# Altium schematic sheet _io.SchDoc
size Tabloid
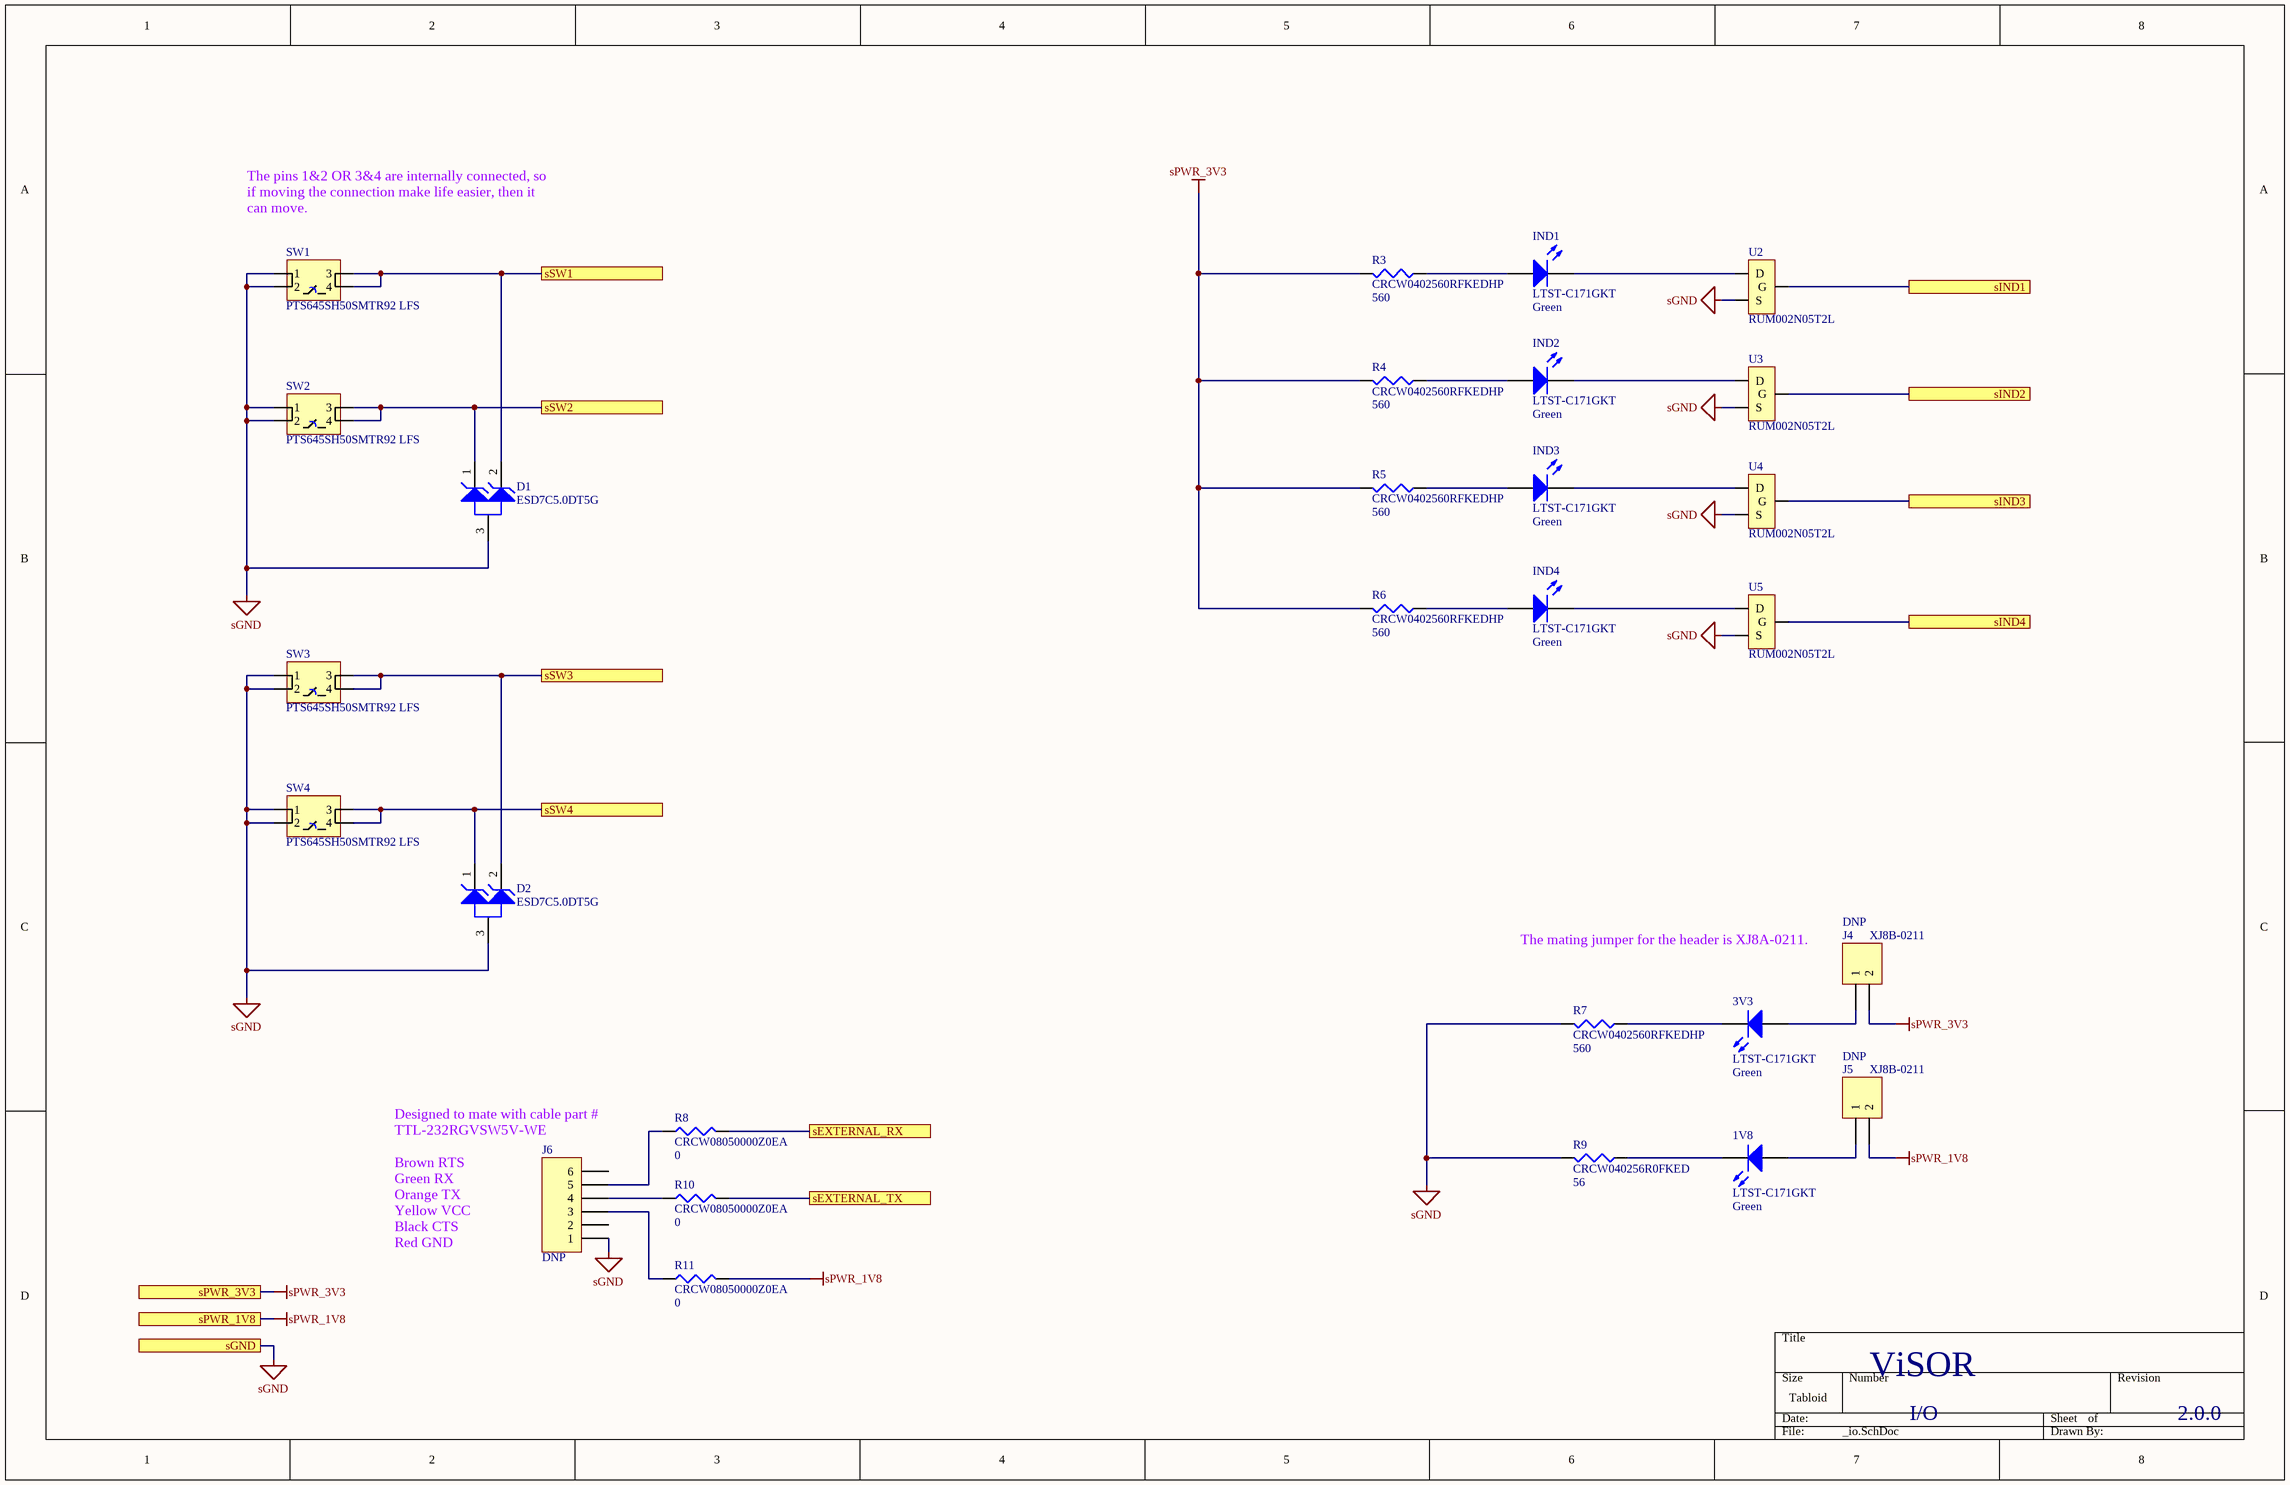
[diagram p0: _io.SchDoc]

## Parts
1V8  LTST-C171GKT  Color: Green  [0805]
3V3  LTST-C171GKT  Color: Green  [0805]
D1  ESD7C5.0DT5G  [ONSC-SOT-723-3-631AA-01_V]
D2  ESD7C5.0DT5G  [ONSC-SOT-723-3-631AA-01_V]
IND1  LTST-C171GKT  Color: Green  [0805]
IND2  LTST-C171GKT  Color: Green  [0805]
IND3  LTST-C171GKT  Color: Green  [0805]
IND4  LTST-C171GKT  Color: Green  [0805]
J4  XJ8B-0211  [HDR1X2]
J5  XJ8B-0211  [HDR1X2]
J6  DNP  [HDR1X6]
R3  CRCW0402560RFKEDHP  value 560  [0402]
R4  CRCW0402560RFKEDHP  value 560  [0402]
R5  CRCW0402560RFKEDHP  value 560  [0402]
R6  CRCW0402560RFKEDHP  value 560  [0402]
R7  CRCW0402560RFKEDHP  value 560  [0402]
R8  CRCW08050000Z0EA  value 0  [6-0805_M]
R9  CRCW040256R0FKED  value 56  [0402]
R10  CRCW08050000Z0EA  value 0  [6-0805_M]
R11  CRCW08050000Z0EA  value 0  [6-0805_M]
SW1  PTS645SH50SMTR92 LFS  [PTS645SH50SMTR92 LFS]
SW2  PTS645SH50SMTR92 LFS  [PTS645SH50SMTR92 LFS]
SW3  PTS645SH50SMTR92 LFS  [PTS645SH50SMTR92 LFS]
SW4  PTS645SH50SMTR92 LFS  [PTS645SH50SMTR92 LFS]
U2  RUM002N05T2L  [RUM002N05T2L]
U3  RUM002N05T2L  [RUM002N05T2L]
U4  RUM002N05T2L  [RUM002N05T2L]
U5  RUM002N05T2L  [RUM002N05T2L]

## Ports
sEXTERNAL_RX, sEXTERNAL_TX, sGND, sIND1, sIND2, sIND3, sIND4, sPWR_1V8, sPWR_3V3, sSW1, sSW2, sSW3, sSW4

## Nets
sGND: D1.3(A) D2.3(A) J6.1 R7.2 R9.2 SW1.1 SW1.2 SW2.1 SW2.2 SW3.1 SW3.2 SW4.1 SW4.2 U2.2(S) U3.2(S) U4.2(S) U5.2(S) ; port sGND
sPWR_1V8: J5.2 R11.2 ; port sPWR_1V8
sPWR_3V3: J4.2 R3.2 R4.2 R5.2 R6.2 ; port sPWR_3V3
sEXTERNAL_RX: R8.2 ; port sEXTERNAL_RX
sEXTERNAL_TX: R10.2 ; port sEXTERNAL_TX
sIND1: U2.1(G) ; port sIND1
sIND2: U3.1(G) ; port sIND2
sIND3: U4.1(G) ; port sIND3
sIND4: U5.1(G) ; port sIND4
sSW1: D1.2(K2) SW1.3 SW1.4 ; port sSW1
sSW2: D1.1(K1) SW2.3 SW2.4 ; port sSW2
sSW3: D2.2(K2) SW3.3 SW3.4 ; port sSW3
sSW4: D2.1(K1) SW4.3 SW4.4 ; port sSW4
Net1V8_1: 1V8.1(A) J5.1
Net1V8_2: 1V8.2(K) R9.1
Net3V3_1: 3V3.1(A) J4.1
Net3V3_2: 3V3.2(K) R7.1
NetIND1_1: IND1.1(A) R3.1
NetIND1_2: IND1.2(K) U2.3(D)
NetIND2_1: IND2.1(A) R4.1
NetIND2_2: IND2.2(K) U3.3(D)
NetIND3_1: IND3.1(A) R5.1
NetIND3_2: IND3.2(K) U4.3(D)
NetIND4_1: IND4.1(A) R6.1
NetIND4_2: IND4.2(K) U5.3(D)
NetJ6_3: J6.3 R11.1
NetJ6_4: J6.4 R10.1
NetJ6_5: J6.5 R8.1

Not connected (* = marked no-connect by the designer): J6 2 6

## Notes on the sheet
- The pins 1&2 OR 3&4 are internally connected, so if moving the connection make life easier, then it can move.
- (near J4) The mating jumper for the header is XJ8A-0211.
- (near J6) Designed to mate with cable part # TTL-232RGVSW5V-WE
  Brown	RTS
  Green	RX
  Orange	TX
  Yellow	VCC
  Black	CTS
  Red	GND
- ViSOR
- I/O
- 2.0.0

## Library data of the parts
1V8 3V3 IND1-IND4 = LTST-C171GKT: LED
D1 D2 = CMP-1063-00208-1: Transient Voltage Suppressor, Micro-Packaged Diode for ESD Protection, 3-Pin SOT-723, Pb-Free, Tape and Reel; Manufacturer: On Semiconductor; C Max (pF): 6.2; Direction: Unidirectional; IR Max (uA): 0.5; V(BR) Min (V): 11; Number of Lines: 2; VRWM Max (V): 5; ComponentLink2Description: Datasheet; PackageVersion: Rev. D, 08/2009; PackageDescription: 3-Pin Small Outline Transistor, Body 1.2 x 0.8 mm, Pitch 0.4 mm; ComponentLink1URL: http://www.onsemi.com/; ComponentLink1Description: Manufacturer URL; RoHS: Pb-Free; DatasheetVersion: Rev. 3; Mounting Technology: Surface Mount; ComponentLink3URL: http://www.onsemi.com/pub_link/Collateral/631AA.PDF; Packing: Tape and Reel; ComponentLink2URL: http://www.onsemi.cn/pub_link/Collateral/ESD7C3.3D-D.PDF; PackageReference: SOT-723-3-631AA-01; ComponentLink3Description: Package Specification; PartNumber: ESD7C5.0DT5G
J4 J5 = Header 2: Header, 2-Pin; LatestRevisionDate: 17-Jul-2002; LatestRevisionNote: Re-released for DXP Platform.; Publisher: Altium Limited; DNP: DNP
J6 = Header 6: Header, 6-Pin; LatestRevisionDate: 17-Jul-2002; LatestRevisionNote: Re-released for DXP Platform.; Publisher: Altium Limited
R3-R7 R9 = CRCW0402xxxxFKED: 0.125W, -55-155C, 1005, 50V, ±1%
R8 R10 R11 = Res3: 0Ω Resistor; Published: 8-Jun-2000; LatestRevisionDate: 29-May-2009; LatestRevisionNote: IPC-7351 Footprint Added.; PackageReference: J1-0603; Publisher: Altium Limited; PackageDescription: Chip Resistor
SW1-SW4 = PTS645SH50SMTR92 LFS: Tactile Switch
U2-U5 = RUM002N05T2L: MOSFET N-CH 50V 0.2A 3VMT